# Altium project Click_ESP32.PrjPcb
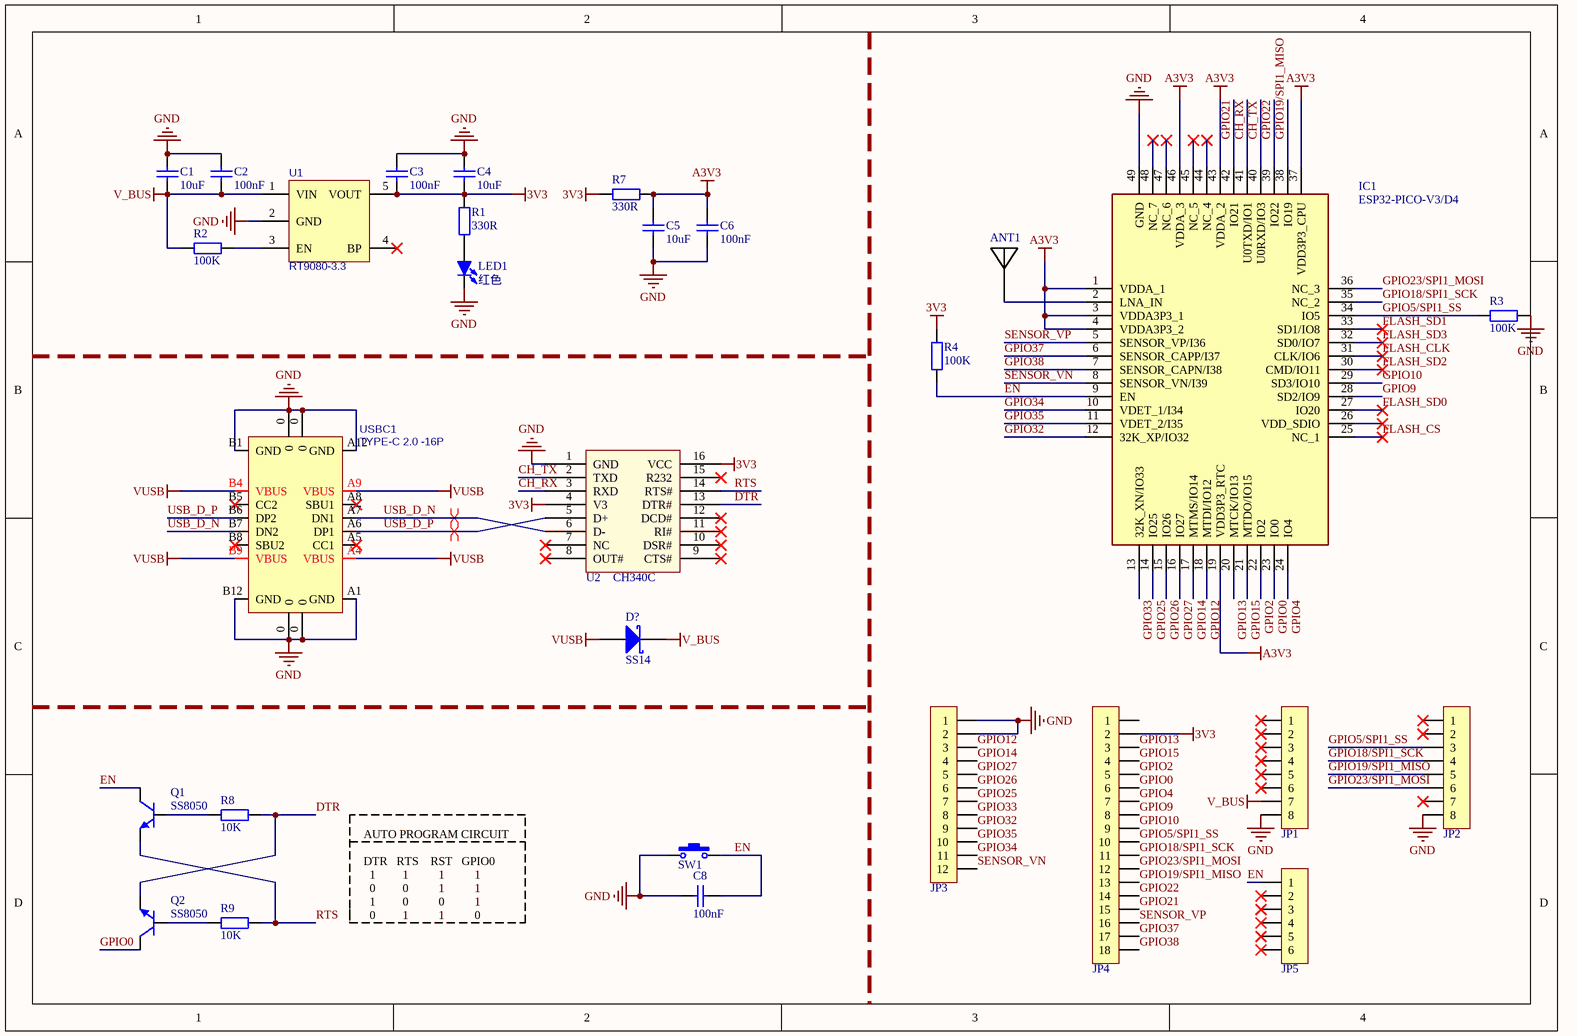
[diagram p0: Main.SchDoc]
1 sheet, 29 parts. Net scope: global (net labels, ports and power ports of the same name join across sheets).
Board file: Main.PcbDoc

## Sheet Main.SchDoc
size A4; SheetNumber: 1; SheetTotal: 1

### Parts
ANT1  ANT_CERAMICS  [ANT-Rainsun-AN5120]  (value not drawn)
C1  10uF  [C0603_L]
C2  100nF  [C0402_M]
C3  100nF  [C0402_M]
C4  10uF  [C0603_L]
C5  10uF  [C0603_L]
C6  100nF  [C0402_M]
C8  100nF  [C0402_M]
D?  SS14  [SMA]
IC1  ESP32-PICO-V3/D4  [ESP32PICOV3]
JP1  HDR-1X8  [HDR2.54-LI-8P]  (value not drawn)
JP2  HDR-1X8  [HDR2.54-LI-8P]  (value not drawn)
JP3  HDR-1X12  [HDR2.54-LI-12P]  (value not drawn)
JP4  HDR-1X18  [HDR2.54-LI-18P]  (value not drawn)
JP5  HDR-1X6  [HDR2.54-LI-6P]  (value not drawn)
LED1  红色  [LED0603_R]
Q1  SS8050  [SOT23-3N]
Q2  SS8050  [SOT23-3N]
R1  330R  [R0402_M]
R2  100K  [R0402_M]
R3  100K  [R0402_M]
R4  100K  [R0402_M]
R7  330R  [R0402_M]
R8  10K  [R0402_M]
R9  10K  [R0402_M]
SW1  3x6x5  [SW SMD-3*6*2.5]  (value not drawn)
U1  RT9080-3.3  [SOT-23-5]
U2  CH340C  [SOIC-16]
USBC1  TYPE-C 2.0 -16P  [USB-C-SMD_16P]

### Nets
3V3: C3.1 C4.1 JP4.2 R1.1 R4.1 R7.1 U1.5(VOUT) U2.4(V3) U2.16(VCC)
A3V3: C5.2 C6.2 IC1.1(VDDA_1) IC1.3(VDDA3P3_1) IC1.4(VDDA3P3_2) IC1.19(VDD3P3_RTC) IC1.37(VDD3P3_CPU) IC1.43(VDDA_2) IC1.46(VDDA_3) R7.2
GND: C1.2 C2.2 C3.2 C4.2 C5.1 C6.1 C8.2 IC1.49(GND) JP1.8 JP2.8 JP3.1 JP3.2 LED1.2(K) R3.2 SW1.1 U1.2(GND) U2.1(GND) USBC1.0 USBC1.A1(GND) USBC1.A12(GND) USBC1.B1(GND) USBC1.B12(GND)
V_BUS: C1.1 C2.1 D?.2(K) JP1.7 R2.1 U1.1(VIN)
VUSB: D?.1(A) USBC1.A4(VBUS) USBC1.A9(VBUS) USBC1.B4(VBUS) USBC1.B9(VBUS)
CH_RX: IC1.41(U0TXD/IO1) U2.3(RXD)
CH_TX: IC1.40(U0RXD/IO3) U2.2(TXD)
DTR: Q2.2(E) R8.2 U2.13(DTR#)
EN: C8.1 IC1.9(EN) JP5.1 Q1.3(C) R4.2 SW1.2
FLASH_CLK: IC1.31(CLK/IO6)
FLASH_CS: IC1.25(NC_1)
FLASH_SD0: IC1.27(IO20)
FLASH_SD1: IC1.33(SD1/IO8)
FLASH_SD2: IC1.30(CMD/IO11)
FLASH_SD3: IC1.32(SD0/IO7)
GPIO0: IC1.23(IO0) JP4.6 Q2.3(C)
GPIO2: IC1.22(IO2) JP4.5
GPIO4: IC1.24(IO4) JP4.7
GPIO5/SPI1_SS: IC1.34(IO5) JP2.3 JP4.10 R3.1
GPIO9: IC1.28(SD2/IO9) JP4.8
GPIO10: IC1.29(SD3/IO10) JP4.9
GPIO12: IC1.18(MTDI/IO12) JP3.3
GPIO13: IC1.20(MTCK/IO13) JP4.3
GPIO14: IC1.17(MTMS/IO14) JP3.4
GPIO15: IC1.21(MTDO/IO15) JP4.4
GPIO18/SPI1_SCK: IC1.35(NC_2) JP2.4 JP4.11
GPIO19/SPI1_MISO: IC1.38(IO19) JP2.5 JP4.13
GPIO21: IC1.42(IO21) JP4.15
GPIO22: IC1.39(IO22) JP4.14
GPIO23/SPI1_MOSI: IC1.36(NC_3) JP2.6 JP4.12
GPIO25: IC1.14(IO25) JP3.7
GPIO26: IC1.15(IO26) JP3.6
GPIO27: IC1.16(IO27) JP3.5
GPIO32: IC1.12(32K_XP/IO32) JP3.9
GPIO33: IC1.13(32K_XN/IO33) JP3.8
GPIO34: IC1.10(VDET_1/I34) JP3.11
GPIO35: IC1.11(VDET_2/I35) JP3.10
GPIO37: IC1.6(SENSOR_CAPP/I37) JP4.17
GPIO38: IC1.7(SENSOR_CAPN/I38) JP4.18
RTS: Q1.2(E) R9.2 U2.14(RTS#)
SENSOR_VN: IC1.8(SENSOR_VN/I39) JP3.12
SENSOR_VP: IC1.5(SENSOR_VP/I36) JP4.16
USB_D_N: U2.6(D-) USBC1.A7(DN1) USBC1.B7(DN2)
USB_D_P: U2.5(D+) USBC1.A6(DP1) USBC1.B6(DP2)
NetANT1_1: ANT1.1 IC1.2(LNA_IN)
NetLED1_1: LED1.1(A) R1.2
NetQ1_1: Q1.1(B) R8.1
NetQ2_1: Q2.1(B) R9.1
NetR2_2: R2.2 U1.3(EN)

Not connected (* = marked no-connect by the designer): IC1 26(VDD_SDIO)* 44(NC_4)* 45(NC_5)* 47(NC_6)* 48(NC_7)*; JP1 1* 2* 3* 4* 5* 6*; JP2 1* 2* 7*; JP4 1; JP5 2* 3* 4* 5* 6*; U1 4(BP)*; U2 7(NC)* 8(OUT#)* 9(CTS#)* 10(DSR#)* 11(RI#)* 12(DCD#)* 15(R232)*; USBC1 A5(CC1)* A8(SBU1)* B5(CC2)* B8(SBU2)*

### Layout directives
differential pair: USB_D_N, USB_D_P

### Notes on the sheet
- AUTO PROGRAM CIRCUIT
  DTR   RTS    RST   GPIO0
  1         1          1          1
  0         0          1          1
  1         0          0          1
  0         1          1          0

### Library data of the parts
ANT1 = ANT_CERAMICS: PCB板载天线; 联系卖家，免费技术支持: 唯一出售店铺网址https://shop463601444.taobao.com; BOM名称: PCB板载天线
C1-C6 C8 = C: 贴片电容/MLCC电容; BOM名称: 无极性贴片电容; 联系卖家，免费查找封装: 唯一出售店铺网址https://shop463601444.taobao.com
D? = SS14: 肖特基二极管; 属性: 40V/1A; 以赠品形式获赠本封装库的买家，还可联系卖家免费指导AD软件使用: 封装库来自淘宝卖家ID：黄晶宝石; BOM名称: 肖特基二极管
IC1 = ESP32-PICO-V3: Integrated Circuit; Manufacturer_Name: Espressif Systems; Datasheet Link: https://kr.mouser.com/datasheet/2/891/esp32-pico-v3_datasheet_en-1842685.pdf; Height: 1.04mm; Manufacturer_Part_Number: ESP32-PICO-V3; Mouser Part Number: 356-ESP32-PICO-V3; Mouser Price/Stock: https://www.mouser.co.uk/ProductDetail/Espressif-Systems/ESP32-PICO-V3?qs=GBLSl2Akirs311o8knsnZA%3D%3D
JP1 JP2 = Header 8: 8P接插件; 联系卖家，免费查找封装: 唯一出售店铺网址https://shop463601444.taobao.com; 封装库来自淘宝卖家ID:黄晶宝石: 其他店铺购入均为盗版假冒封装库，请立即申请退款，本店现金奖励20~200元; BOM名称: 8P接插件
JP3 = Header 12: 12P接插件; 联系卖家，免费查找封装: 唯一出售店铺网址https://shop463601444.taobao.com; 封装库来自淘宝卖家ID:黄晶宝石: 其他店铺购入均为盗版假冒封装库，请立即申请退款，本店现金奖励20~200元; BOM名称: 12P接插件
JP4 = Header 18: 18P接插件; 联系卖家，免费查找封装: 唯一出售店铺网址https://shop463601444.taobao.com; 封装库来自淘宝卖家ID:黄晶宝石: 其他店铺购入均为盗版假冒封装库，请立即申请退款，本店现金奖励20~200元; BOM名称: 18P接插件
JP5 = Header 6: 6P接插件; 联系卖家，免费查找封装: 唯一出售店铺网址https://shop463601444.taobao.com; 封装库来自淘宝卖家ID:黄晶宝石: 其他店铺购入均为盗版假冒封装库，请立即申请退款，本店现金奖励20~200元; BOM名称: 6P接插件
LED1 = LED-SMD: 贴片LED; 封装库来自淘宝卖家ID：黄晶宝石: 其他店铺购入均为盗版封装库，请立即申请退款，本店现金奖励20~200元; BOM名称: 贴片LED
Q1 Q2 = 8050-SMD: 高频放大-NPN型; 版权归属: 源创客; 属性: 40V 1.5A 1W 100MHZ; BOM名称: 高频放大-NPN型; 学习资源: www.ooocke.com
R1-R4 R7-R9 = R: 贴片电阻; 联系卖家，免费查找封装: 唯一出售店铺网址https://shop463601444.taobao.com; BOM名称: 贴片电阻
SW1 = SW 3x6: 3x6轻触开关; 联系卖家，免费查找封装: 唯一出售店铺网址https://shop463601444.taobao.com; 封装库来自淘宝卖家ID：黄晶宝石: 其他店铺购入的，请立即申请退款，本店现金奖励20~500元; BOM名称: 3x6轻触开关
U1 = RT9193-18GB: LDO 1.8V/0.3A; 芯片厂商: RICHTEK; 封装库来自淘宝卖家ID：黄晶宝石: 其他店铺购入的买家，请立即申请退款，本店现金奖励20~1000元; BOM名称: RT9193-18GB
U2 = CH340C: 联系卖家，免费技术支持: 唯一出售店铺网址https://shop463601444.taobao.com
USBC1 = USB2.0_Type-C_16Pin: USB2.0_Type-C_16Pin母座; 联系卖家 免费技术支持: 封装库来自淘宝卖家ID：黄晶宝石